# EAGLE design ArduinoBoardMKII (EAGLE 9.1.3)
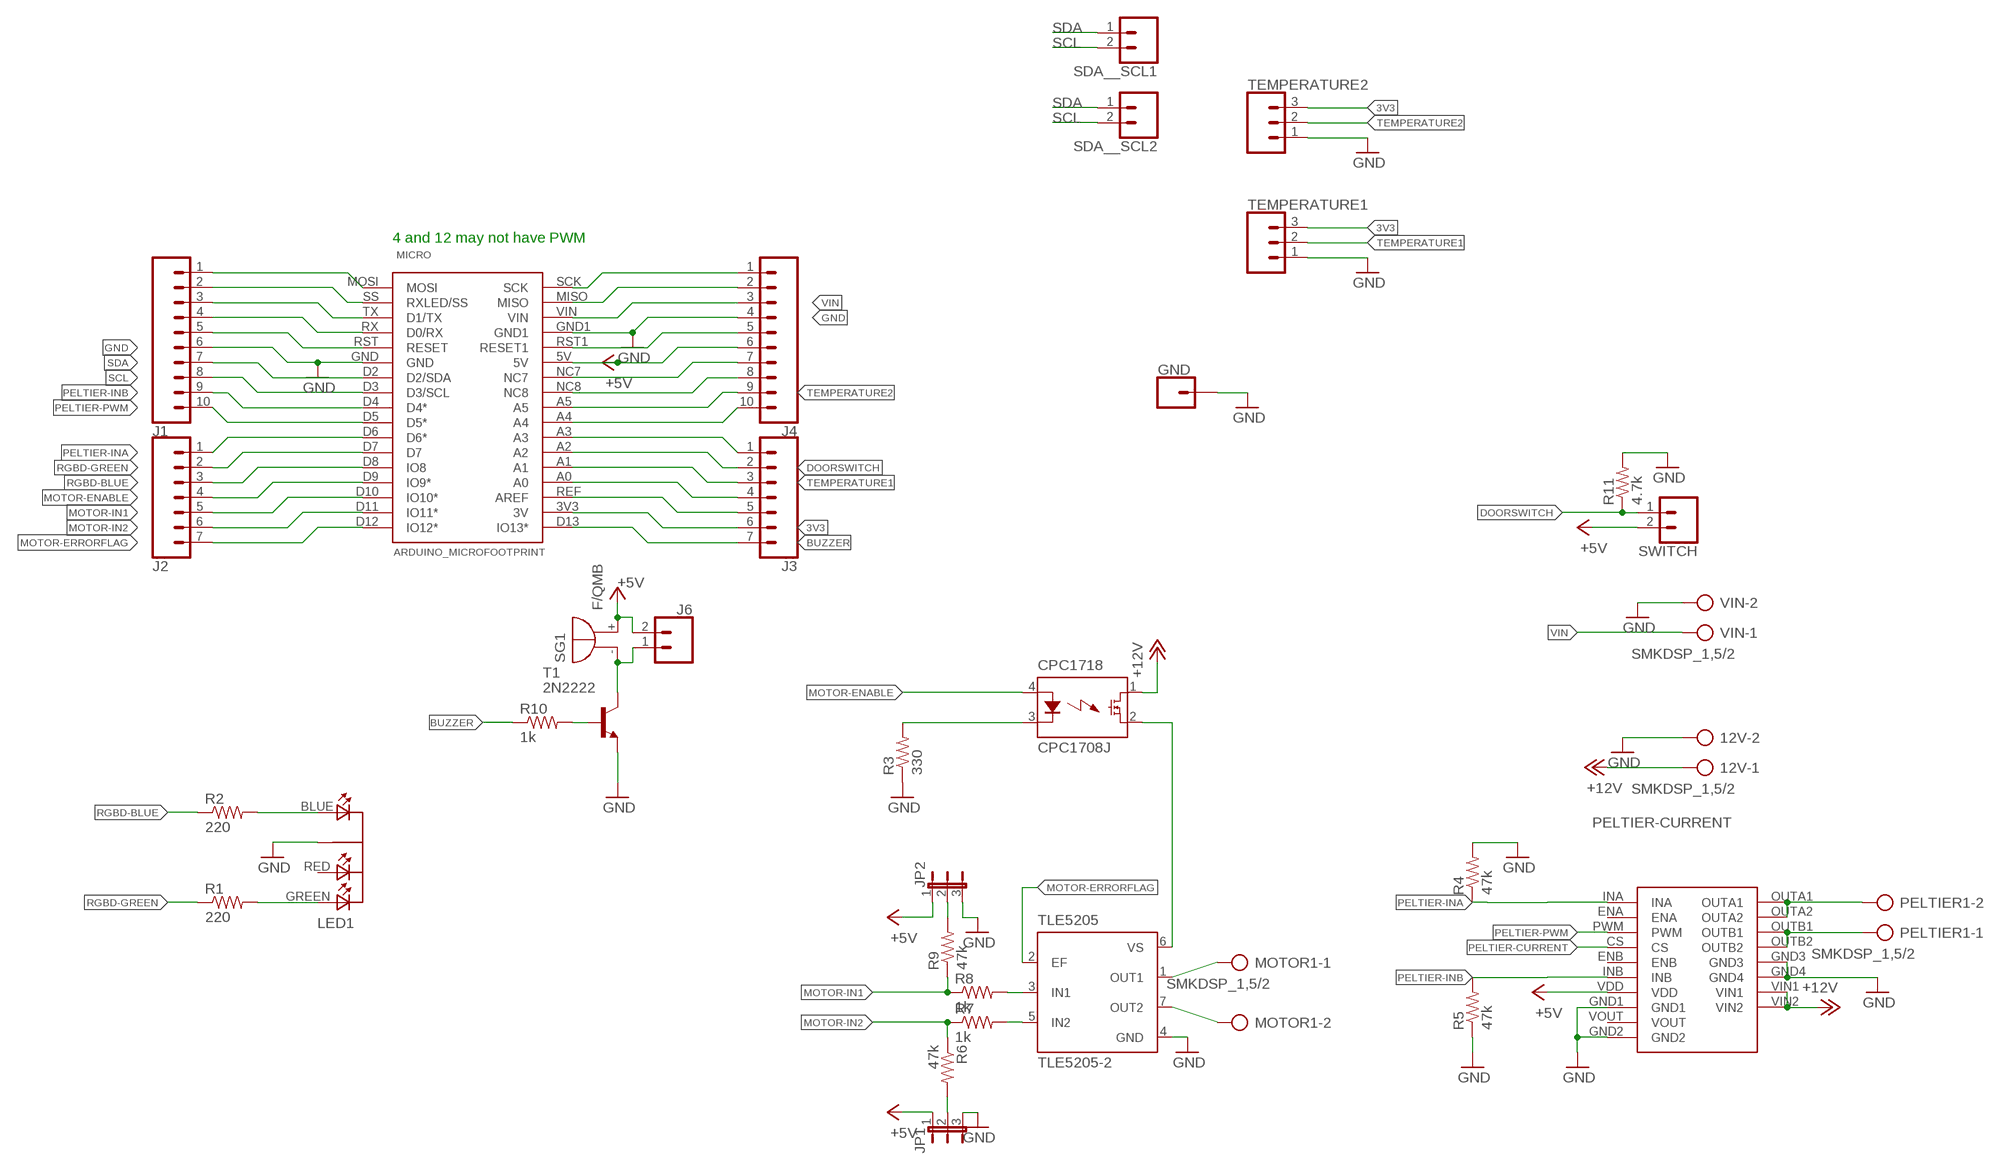
[diagram p0: schematic, sheet 1]

## Parts
12V  SMKDSP_1,5/2  [SMKDSP_1,5/2]
CPC1718  CPC1708J  [I4-PAC]
GND  CONN_01  [1X01]
J1  CONN_10LOCK  [1X10_LOCK]
J2  CONN_07LOCK  [1X07_LOCK]
J3  CONN_07LOCK  [1X07_LOCK]
J4  CONN_10LOCK  [1X10_LOCK]
J6  CONN_021X02_NO_SILK  [1X02_NO_SILK]
JP1  JP2E  [JP2]
JP2  JP2E  [JP2]
LED1  LED-DIP-3  [DIP-4]
MICRO  ARDUINO_MICROFOOTPRINT  [ARDUINO-MICRO]
MOTOR1  SMKDSP_1,5/2  [SMKDSP_1,5/2]
PELTIER1  SMKDSP_1,5/2  [SMKDSP_1,5/2]
R1  220  R-US_0207/10  [0207/10]
R2  220  R-US_0207/10  [0207/10]
R3  330  R-US_0207/10  [0207/10]
R4  47k  R-US_0207/10  [0207/10]
R5  47k  R-US_0207/10  [0207/10]
R6  47k  R-US_0207/12  [0207/12]
R7  1k  R-US_0207/12  [0207/12]
R8  1k  R-US_0207/12  [0207/12]
R9  47k  R-US_0207/12  [0207/12]
R10  1k  R-US_0207/7  [0207/7]
R11  4.7k  R-US_0207/10  [0207/10]
SDA__SCL1  CONN_02PTH3  [1X02_LONGPADS]
SDA__SCL2  CONN_02PTH3  [1X02_LONGPADS]
SG1  F/QMB  [F/QMB]
SWITCH  CONN_02PTH3  [1X02_LONGPADS]
T1  2N2222  [TO18]
TEMPERATURE1  CONN_03LONGPADS  [1X03_LONGPADS]
TEMPERATURE2  CONN_03LONGPADS  [1X03_LONGPADS]
TLE5205  TLE5205-2  [P-TO220-7-11]
VIN  SMKDSP_1,5/2  [SMKDSP_1,5/2]
VNH5019  VNH5019VNH5019BOARD  [DIP3302W60P254L2400H500Q20B]

## Nets
3V3: J3.6 MICRO.3V3(3V) TEMPERATURE1.3 TEMPERATURE2.3
+5V: J4.6 J6.2 JP1.1 JP2.1 MICRO.5V SG1.+(-) SWITCH.2 VNH5019.VDD
+12V: 12V.1 CPC1718.1(DS1) VNH5019.VIN1 VNH5019.VIN2
BUZZER: J3.7 MICRO.D13(IO13*) R10.1
DOORSWITCH: J3.2 MICRO.A2 R11.1 SWITCH.1
GND: 12V.2 GND.1 J1.6 J4.4 JP1.3 JP2.3 LED1.COMMON_CATHODE(COM-CATHODE) MICRO.GND MICRO.GND1 R3.1 R4.2 R5.1 R11.2 T1.1(E) TEMPERATURE1.1 TEMPERATURE2.1 TLE5205.4(GND) VIN.2 VNH5019.GND1 VNH5019.GND2 VNH5019.GND3 VNH5019.GND4
IN1: R8.2 TLE5205.3(IN1)
IN2: R7.2 TLE5205.5(IN2)
MOTOR-ENABLE: CPC1718.4(A) J2.4 MICRO.D9(IO9*)
MOTOR-ERRORFLAG: J2.7 MICRO.D12(IO12*) TLE5205.2(EF)
MOTOR-IN1: J2.5 MICRO.D10(IO10*) R8.1 R9.1
MOTOR-IN2: J2.6 MICRO.D11(IO11*) R6.1 R7.1
MOTOR-OUT1: MOTOR1.1 TLE5205.1(OUT1)
MOTOR-OUT2: MOTOR1.2 TLE5205.7(OUT2)
N$2: LED1.BLUE R2.2
N$3: LED1.GREEN R1.2
N$4: JP1.2 R6.2
N$6: J1.5 MICRO.RST(RESET)
N$7: J1.4 MICRO.RX(D0/RX)
N$8: J1.3 MICRO.TX(D1/TX)
N$9: J1.2 MICRO.SS(RXLED/SS)
N$10: J1.1 MICRO.MOSI
N$11: J3.1 MICRO.A3
N$12: JP2.2 R9.2
N$13: J6.1 SG1.-(+) T1.3(C)
N$14: J3.4 MICRO.A0
N$15: J3.5 MICRO.REF(AREF)
N$17: R10.2 T1.2(B)
N$18: J4.10 MICRO.A4
N$19: J4.5 MICRO.RST1(RESET1)
N$20: J4.8 MICRO.NC8
N$23: J4.7 MICRO.NC7
N$25: J4.2 MICRO.MISO
N$26: J4.1 MICRO.SCK
PELTIER-CURRENT: VNH5019.CS
PELTIER-INA: J2.1 MICRO.D6(D6*) R4.1 VNH5019.INA
PELTIER-INB: J1.9 MICRO.D4(D4*) R5.2 VNH5019.INB
PELTIER-OUTA: PELTIER1.2 VNH5019.OUTA1 VNH5019.OUTA2
PELTIER-OUTB: PELTIER1.1 VNH5019.OUTB1 VNH5019.OUTB2
PELTIER-PWM: J1.10 MICRO.D5(D5*) VNH5019.PWM
POST-OPTO-DIODE: CPC1718.3(K) R3.2
RELAY-TO-MOTORCONTROLLER: CPC1718.2(DS2) TLE5205.6(VS)
RGBD-BLUE: J2.3 MICRO.D8(IO8) R2.1
RGBD-GREEN: J2.2 MICRO.D7 R1.1
SCL: J1.8 MICRO.D3(D3/SCL) SDA__SCL1.2 SDA__SCL2.2
SDA: J1.7 MICRO.D2(D2/SDA) SDA__SCL1.1 SDA__SCL2.1
TEMPERATURE1: J3.3 MICRO.A1 TEMPERATURE1.2
TEMPERATURE2: J4.9 MICRO.A5 TEMPERATURE2.2
VIN: J4.3 MICRO.VIN VIN.1
Unconnected: LED1.RED VNH5019.ENA VNH5019.ENB VNH5019.VOUT

## Notes on the sheet
- 4 and 12 may not have PWM

## Library data of the parts
12V MOTOR1 PELTIER1 VIN = con-phoenix-smkdsp:SMKDSP_1,5/2: Printklemme, Nennstrom: 17,5 A, Bemessungsspannung: 250 V, Raster: 5,0 mm Source: http://eshop.phoenixcontact.de .. 1733415.pdf; MF: FARNELL; MPN: 1733570; OC_FARNELL: 3041244; OC_NEWARK: 69C8588
CPC1718 = relay:CPC1708J: Single-Pole, Normally Open i4-PAC (TM) DC Power Relay Source: Data sheet <http://www.clare.com/home/pdfs.nsf/www/CPC1708.pdf/$file/CPC1708.pdf>
GND = SparkFun-Connectors:CONN_01: Single connection point. Often used as Generic Header-pin footprint for 0.1 inch spaced/style header connections On any of the 0.1 inch spaced packages, you can populate with these: Break Away Headers - Straight <https://www.sparkfun.com/products/116> (PRT-00116) Break Away Male Headers - Right Angle <https://www.sparkfun.com/products/553> (PRT-00553) Female Headers <https://www.sparkfun.com/products/115> (PRT-00115) Break Away Headers - Machine Pin <https://www.sparkfun.com/products/117> (PRT-00117) Break Away Female Headers - Swiss Machine Pin <https://www.sparkfun.com/products/743> (PRT-00743) This device is also useful as a general connection point to wire up your design to another part of your project. Our various solder wires solder well into these plated through hole pads. Hook-Up Wire - Assortment (Stranded, 22 AWG) <https://www.sparkfun.com/products/11375> (PRT-11375) Hook-Up Wire - Assortment (Solid Core, 22 AWG) <https://www.sparkfun.com/products/11367> (PRT-11367) View the entire wire category on our website here <https://www.sparkfun.com/categories/141> Special notes: SMTSO-256-ET is a "flush mount" nut for a 4-40 screw. We mostly use this on specialty testbeds; it is a nice way to connect hardware to your PCB at an adjustable hieght. Also note, the SNAP packages are for using a snappable style connector. We sell a baggie of snaps and they are also used on two LilyPad designs: Snap Assortment - 30 pack (male and female) <https://www.sparkfun.com/products/11347> (DEV-11347) LilyPad Arduino SimpleSnap <https://www.sparkfun.com/products/10941> (DEV-10941) LilyPad SimpleSnap Protoboard <https://www.sparkfun.com/products/10940> (DEV-10940)
J1 J4 = SparkFun-Connectors:CONN_10: Multi connection point. Often used as Generic Header-pin footprint for 0.1 inch spaced/style header connections On any of the 0.1 inch spaced packages, you can populate with these: Break Away Headers - Straight <https://www.sparkfun.com/products/116> (PRT-00116) Break Away Male Headers - Right Angle <https://www.sparkfun.com/products/553> (PRT-00553) Female Headers <https://www.sparkfun.com/products/115> (PRT-00115) Break Away Headers - Machine Pin <https://www.sparkfun.com/products/117> (PRT-00117) Break Away Female Headers - Swiss Machine Pin <https://www.sparkfun.com/products/743> (PRT-00743) Arduino Stackable Header - 10 Pin <https://www.sparkfun.com/products/11376> (PRT-11376) For SCREWTERMINALS and SPRING TERMINALS visit here: Screw Terimnals on SparkFun.com <https://www.sparkfun.com/search/results?term=Screw+Terminals> (5mm/3.5mm/2.54mm spacing) This device is also useful as a general connection point to wire up your design to another part of your project. Our various solder wires solder well into these plated through hole pads. Hook-Up Wire - Assortment (Stranded, 22 AWG) <https://www.sparkfun.com/products/11375> (PRT-11375) Hook-Up Wire - Assortment (Solid Core, 22 AWG) <https://www.sparkfun.com/products/11367> (PRT-11367) View the entire wire category on our website here <https://www.sparkfun.com/categories/141> Special notes: Molex polarized connector foot print use with SKU : PRT-08231 with associated crimp pins and housings. 1MM SMD Version SKU: PRT-10208 NOTES ON THE VARIANTS LOCK and LOCK_LONGPADS... This footprint was designed to help hold the alignment of a through-hole component (i.e. 6-pin header) while soldering it into place. You may notice that each hole has been shifted either up or down by 0.005 of an inch from it's more standard position (which is a perfectly straight line). This slight alteration caused the pins (the squares in the middle) to touch the edges of the holes. Because they are alternating, it causes a "brace" to hold the component in place. 0.005 has proven to be the perfect amount of "off-center" position when using our standard breakaway headers. Although looks a little odd when you look at the bare footprint, once you have a header in there, the alteration is very hard to notice. Also,if you push a header all the way into place, it is covered up entirely on the bottom side.
J2 J3 = SparkFun-Connectors:CONN_07: Multi connection point. Often used as Generic Header-pin footprint for 0.1 inch spaced/style header connections On any of the 0.1 inch spaced packages, you can populate with these: Break Away Headers - Straight <https://www.sparkfun.com/products/116> (PRT-00116) Break Away Male Headers - Right Angle <https://www.sparkfun.com/products/553> (PRT-00553) Female Headers <https://www.sparkfun.com/products/115> (PRT-00115) Break Away Headers - Machine Pin <https://www.sparkfun.com/products/117> (PRT-00117) Break Away Female Headers - Swiss Machine Pin <https://www.sparkfun.com/products/743> (PRT-00743) For SCREWTERMINALS and SPRING TERMINALS visit here: Screw Terimnals on SparkFun.com <https://www.sparkfun.com/search/results?term=Screw+Terminals> (5mm/3.5mm/2.54mm spacing) This device is also useful as a general connection point to wire up your design to another part of your project. Our various solder wires solder well into these plated through hole pads. Hook-Up Wire - Assortment (Stranded, 22 AWG) <https://www.sparkfun.com/products/11375> (PRT-11375) Hook-Up Wire - Assortment (Solid Core, 22 AWG) <https://www.sparkfun.com/products/11367> (PRT-11367) View the entire wire category on our website here <https://www.sparkfun.com/categories/141> Special notes: Molex polarized connector foot print use with SKU : PRT-08231 with associated crimp pins and housings. 1MM SMD Version SKU: PRT-10208 NOTES ON THE VARIANTS LOCK and LOCK_LONGPADS... This footprint was designed to help hold the alignment of a through-hole component (i.e. 6-pin header) while soldering it into place. You may notice that each hole has been shifted either up or down by 0.005 of an inch from it's more standard position (which is a perfectly straight line). This slight alteration caused the pins (the squares in the middle) to touch the edges of the holes. Because they are alternating, it causes a "brace" to hold the component in place. 0.005 has proven to be the perfect amount of "off-center" position when using our standard breakaway headers. Although looks a little odd when you look at the bare footprint, once you have a header in there, the alteration is very hard to notice. Also,if you push a header all the way into place, it is covered up entirely on the bottom side.
J6 SDA__SCL1 SDA__SCL2 SWITCH = SparkFun-Connectors:CONN_02: Multi connection point. Often used as Generic Header-pin footprint for 0.1 inch spaced/style header connections On any of the 0.1 inch spaced packages, you can populate with these: Break Away Headers - Straight <https://www.sparkfun.com/products/116> (PRT-00116) Break Away Male Headers - Right Angle <https://www.sparkfun.com/products/553> (PRT-00553) Female Headers <https://www.sparkfun.com/products/115> (PRT-00115) Break Away Headers - Machine Pin <https://www.sparkfun.com/products/117> (PRT-00117) Break Away Female Headers - Swiss Machine Pin <https://www.sparkfun.com/products/743> (PRT-00743) For SCREWTERMINALS and SPRING TERMINALS visit here: Screw Terimnals on SparkFun.com <https://www.sparkfun.com/search/results?term=Screw+Terminals> (5mm/3.5mm/2.54mm spacing) This device is also useful as a general connection point to wire up your design to another part of your project. Our various solder wires solder well into these plated through hole pads. Hook-Up Wire - Assortment (Stranded, 22 AWG) <https://www.sparkfun.com/products/11375> (PRT-11375) Hook-Up Wire - Assortment (Solid Core, 22 AWG) <https://www.sparkfun.com/products/11367> (PRT-11367) View the entire wire category on our website here <https://www.sparkfun.com/categories/141> Special notes: Molex polarized connector foot print use with: PRT-08233 with associated crimp pins and housings. 2.54_SCREWTERM for use with PRT-10571. 3.5mm Screw Terminal footprints for PRT-08084 5mm Screw Terminal footprints for use with PRT-08432
JP1 JP2 = jumper:JP2E: JUMPER
LED1 = _led-rgb:LED-DIP-3: RGB DIP LED Edited: brunql DIP 4 Pin Special for AmbilightUSB
MICRO = arduino-micro:ARDUINO_MICRO
R1-R3 R11 = adafruit:R-US_: RESISTOR, American symbol
R4-R9 = resistor:R-US_: RESISTOR, American symbol
R10 = rcl:R-US_: RESISTOR, American symbol; SPICEPREFIX: R
SG1 = buzzer:F/QMB: BUZZER Source: Buerklin; OC_FARNELL: unknown; OC_NEWARK: unknown
T1 = transistor:2N2222: NPN TRANSISTOR
TEMPERATURE1 TEMPERATURE2 = SparkFun-Connectors:CONN_03: Multi connection point. Often used as Generic Header-pin footprint for 0.1 inch spaced/style header connections On any of the 0.1 inch spaced packages, you can populate with these: Break Away Headers - Straight <https://www.sparkfun.com/products/116> (PRT-00116) Break Away Male Headers - Right Angle <https://www.sparkfun.com/products/553> (PRT-00553) Female Headers <https://www.sparkfun.com/products/115> (PRT-00115) Break Away Headers - Machine Pin <https://www.sparkfun.com/products/117> (PRT-00117) Break Away Female Headers - Swiss Machine Pin <https://www.sparkfun.com/products/743> (PRT-00743) Stackable Header - 3 Pin (Female, 0.1") <https://www.sparkfun.com/products/13875> (PRT-13875) For SCREWTERMINALS and SPRING TERMINALS visit here: Screw Terimnals on SparkFun.com <https://www.sparkfun.com/search/results?term=Screw+Terminals> (5mm/3.5mm/2.54mm spacing) This device is also useful as a general connection point to wire up your design to another part of your project. Our various solder wires solder well into these plated through hole pads. Hook-Up Wire - Assortment (Stranded, 22 AWG) <https://www.sparkfun.com/products/11375> (PRT-11375) Hook-Up Wire - Assortment (Solid Core, 22 AWG) <https://www.sparkfun.com/products/11367> (PRT-11367) View the entire wire category on our website here <https://www.sparkfun.com/categories/141> Special notes: Molex polarized connector foot print use with SKU : PRT-08232 with associated crimp pins and housings.
TLE5205 = infineon:TLE5205-2: 5-A H-Bridge for DC-Motor Applications Source: http://www.infineon.com .. tle5205-2.pdf; OC_FARNELL: unknown; OC_NEWARK: unknown
VNH5019 = GEMS:VNH5019

## Board
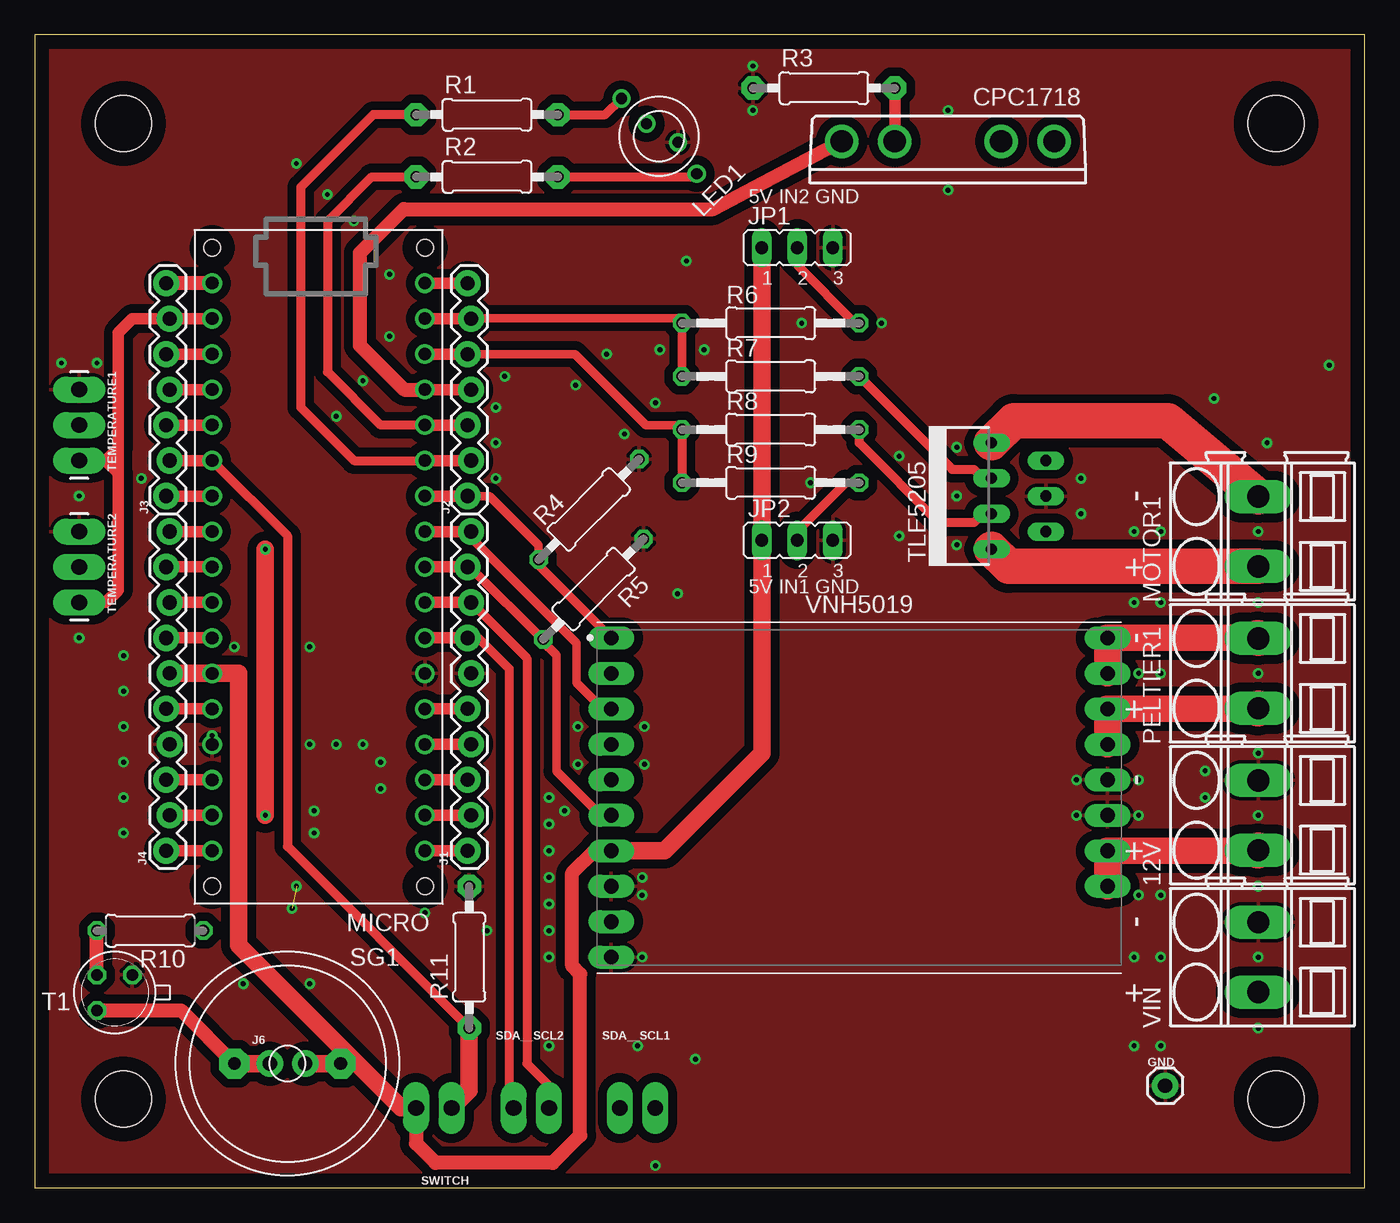
[diagram p1: board, top side]
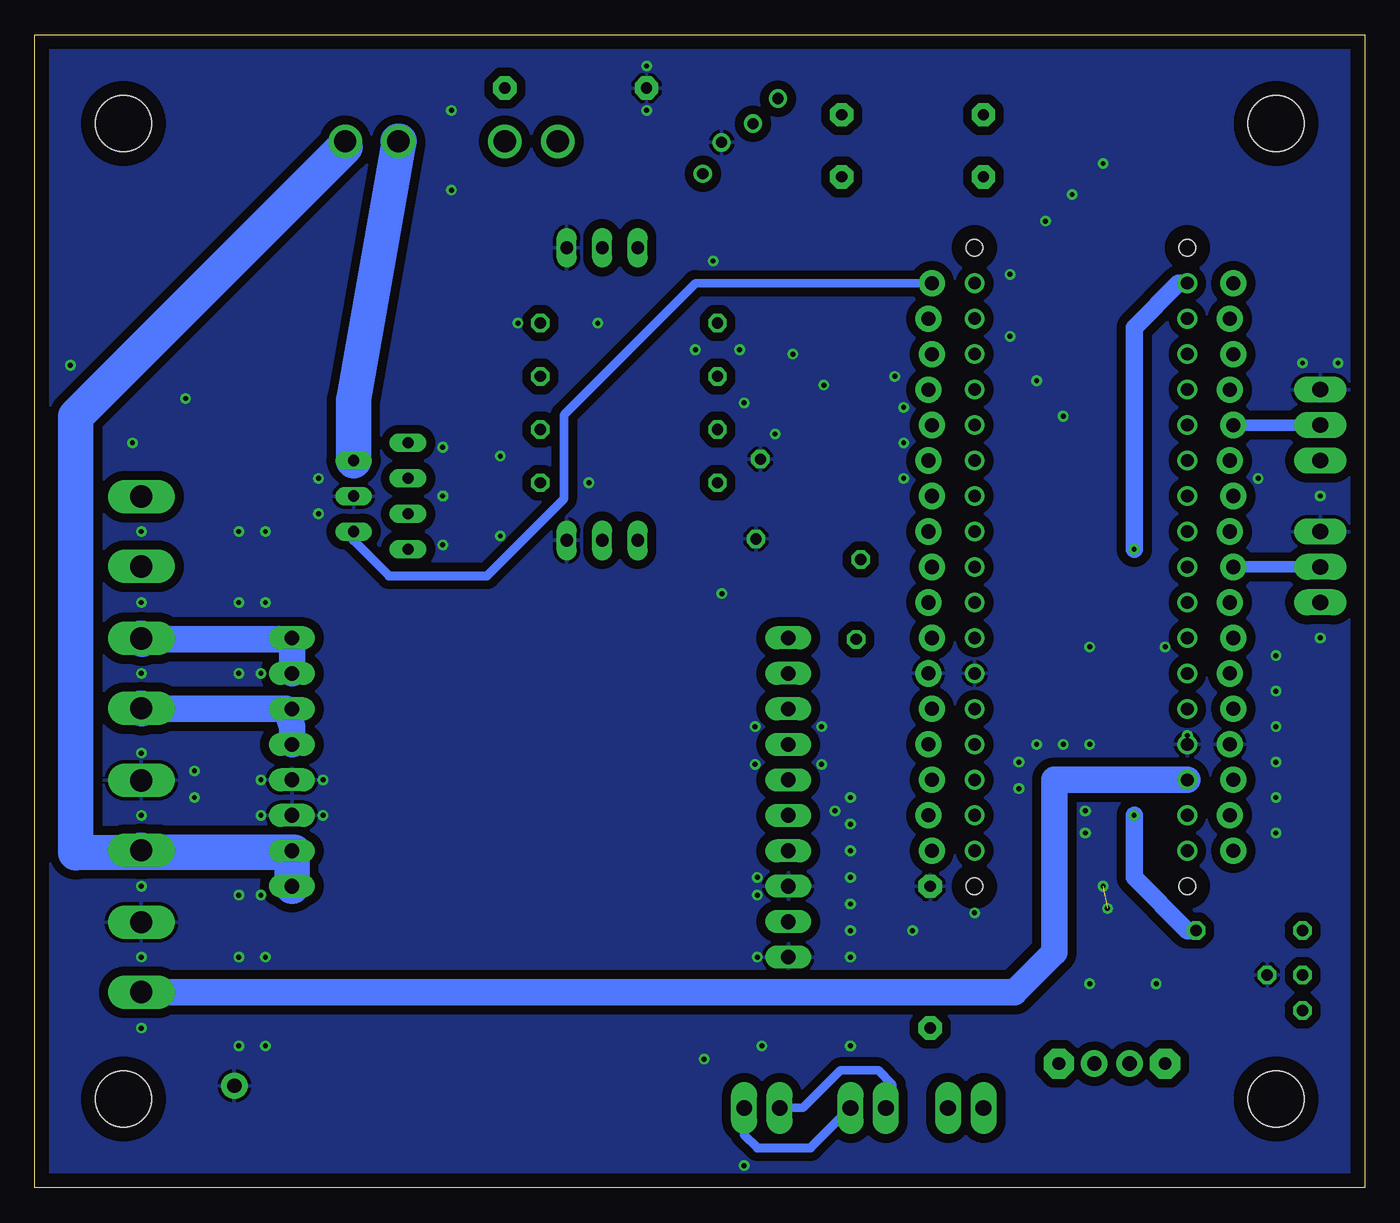
[diagram p2: board, bottom side, seen from below]

Size 95.25 x 82.55 mm. Coordinates in mm from the lower left corner, seen from the top.
Outline: 0,0 95.25,0 95.25,82.55 0,82.55 0,0
Copper layers (1*16): Top 0.035mm / dielectric 1.5mm / Bottom 0.035mm
Design rules "default *": minimum track width 6mil, minimum drill 0.35mm, track to track 25mil, track to pad 20mil, pad to pad 6mil, via to via 25mil, smd to smd 6mil, copper to edge 40mil, drill to drill 6mil, minimum pad ring 10mil, minimum via ring 8mil, stop-mask expansion 4mil, vias tented up to drill 0mil, thermal gap 10mil
Holes 4 mm at 6.35,76.2 88.9,76.2 88.9,6.35 6.35,6.35

### Footprints (pad centres in the part's own frame; a part is rotated, then mirrored left to right if it is on the bottom)
SMKDSP_1,5/2 = drill 1.6 pad 1.8 long: 1 -2.5,0; 2 2.5,0
I4-PAC = drill 1.6 pad 2.3: 1 -7.62,0; 2 -3.81,0; 3 3.81,0; 4 7.62,0
1X01 = drill 1.016 pad 1.88: 1 0,0
1X10_LOCK = drill 1.016 pad 1.88: 1 0,0.127; 2 2.54,-0.127; 3 5.08,0.127; 4 7.62,-0.127; 5 10.16,0.127; 6 12.7,-0.127; 7 15.24,0.127; 8 17.78,-0.127; 9 20.32,0.127; 10 22.86,-0.127
1X07_LOCK = drill 1.016 pad 1.88: 1 0,0.127; 2 2.54,-0.127; 3 5.08,0.127; 4 7.62,-0.127; 5 10.16,0.127; 6 12.7,-0.127; 7 15.24,0.127
1X02_NO_SILK = drill 1.016 pad 1.88: 1 0,0; 2 2.54,0
JP2 = drill 0.914 long: 1 -2.54,0; 2 0,0; 3 2.54,0
DIP-4 = drill 0.8: BLUE 0,5.08; COMMON_CATHODE -0.635,2.54; GREEN 0,-2.54; RED 0,0
ARDUINO-MICRO = drill 0.9: 3V3 16.51,3.81; 5V 16.51,29.21; A0 16.51,8.89; A1 16.51,11.43; A2 16.51,13.97; A3 16.51,16.51; A4 16.51,19.05; A5 16.51,21.59; D2 1.27,26.67; D3 1.27,24.13; D4 1.27,21.59; D5 1.27,19.05; D6 1.27,16.51; D7 1.27,13.97; D8 1.27,11.43; D9 1.27,8.89; D10 1.27,6.35; D11 1.27,3.81; D12 1.27,1.27; D13 16.51,1.27; GND 1.27,29.21; GND1 16.51,34.29; MISO 16.51,39.37; MOSI 1.27,41.91; NC7 16.51,26.67; NC8 16.51,24.13; REF 16.51,6.35; RST 1.27,31.75; RST1 16.51,31.75; RX 1.27,34.29; SCK 16.51,41.91; SS 1.27,39.37; TX 1.27,36.83; VIN 16.51,36.83 | hole 1.2: 1.27,-1.27; 16.51,-1.27; 1.27,44.45; 16.51,44.45
0207/10 = drill 0.813 pad 1.676 octagon: 1 -5.08,0; 2 5.08,0
0207/10' = drill 0.813 octagon: 1 -5.08,0; 2 5.08,0
0207/12 = drill 0.813 octagon: 1 -6.35,0; 2 6.35,0
0207/7 = drill 0.813 octagon: 1 -3.81,0; 2 3.81,0
1X02_LONGPADS = drill 1.118 pad 1.88 long: 1 0,0; 2 2.54,0
F/QMB = drill 0.914 pad 2.159 octagon: + 3.81,0; - -3.81,0
TO18 = drill 0.813 octagon: 1 -1.27,-1.27; 2 1.27,-1.27; 3 1.27,1.27
1X03_LONGPADS = drill 1.118 pad 1.88 long: 1 0,0; 2 2.54,0; 3 5.08,0
P-TO220-7-11 = drill 0.8 pad 1.2 long: 1 -3.81,-1.85; 2 -2.54,-5.75; 3 -1.27,-1.85; 4 0,-5.75; 5 1.27,-1.85; 6 2.54,-5.75; 7 3.81,-1.85
DIP3302W60P254L2400H500Q20B = drill 1.048 pad 1.649 long: CS -17.78,3.81; ENA -17.78,8.89; ENB -17.78,1.27; GND1 -17.78,-6.35; GND2 -17.78,-11.43; GND3 17.78,1.27; GND4 17.78,-1.27; INA -17.78,11.43; INB -17.78,-1.27; OUTA1 17.78,11.43; OUTA2 17.78,8.89; OUTB1 17.78,6.35; OUTB2 17.78,3.81; PWM -17.78,6.35; VDD -17.78,-3.81; VIN1 17.78,-3.81; VIN2 17.78,-6.35; VOUT -17.78,-8.89

### Placement (x,y rotation side)
12V  87.63,26.67 90 top
CPC1718  65.41,74.93 180 top
GND  80.96,7.3 0 top
J1  31.11,24.13 90 top
J2  31.11,49.53 90 top
J3  9.53,49.53 90 top
J4  9.53,24.13 90 top
J6  16.83,8.89 0 top
JP1  54.61,67.31 0 top
JP2  54.61,46.35 0 top
LED1  43.81,76.2 225 top
MICRO  29.21,66.04 180 top
MOTOR1  87.63,46.99 90 top
PELTIER1  87.63,36.83 90 top
R1  32.38,76.83 0 top
R2  32.38,72.39 0 top
R3  56.52,78.74 0 top
R4  47k  [0207/10']  39.69,48.58 45 top
R5  47k  [0207/10']  40.01,42.86 225 top
R6  52.7,61.91 0 top
R7  52.7,58.1 0 top
R8  52.7,54.29 0 top
R9  52.7,50.48 0 top
R10  8.26,18.41 180 top
R11  31.11,16.51 90 top
SDA__SCL1  41.91,5.71 0 top
SDA__SCL2  34.29,5.71 0 top
SG1  18.1,8.89 0 top
SWITCH  29.84,5.71 180 top
T1  5.71,13.97 180 top
TEMPERATURE1  3.17,57.15 270 top
TEMPERATURE2  3.17,46.99 270 top
TLE5205  66.67,49.53 90 top
VIN  87.63,16.51 90 top
VNH5019  59.05,27.94 0 top

### Tracks (layer width: path | path; a pad name or v marks a point on that pad's centre or on a via)
3V3
  Top 0.813: MICRO.3V3 J3.6 6.99,62.23 5.97,61.21 5.97,52.96 | 5.97,52.96 5.08,52.07 | 5.08,52.07 TEMPERATURE1.3 | 5.97,51.18 5.97,42.8 5.08,41.91 TEMPERATURE2.3 | 5.08,52.07 5.97,51.18 | 5.97,51.18 5.97,52.96
+5V
  Top 1.016: SWITCH.2 27.3,3.17 28.7,1.78 37.1,1.78 39.06,3.75 39.06,15.3 38.48,15.88 38.48,22.54 40.08,24.13 VNH5019.VDD
  Top 1.27: VNH5019.VDD 45.09,24.13 52.07,31.11 JP2.1 JP1.1 | J4.6 MICRO.5V 14.61,36.83 14.61,17.35 22.01,9.95 22.49,9.47 | 22.49,9.47 SG1.+ J6.2 | 22.49,9.47 26.24,5.71 SWITCH.2
+12V
  Top 1.905: 87.59,24.13 VNH5019.VIN1 VNH5019.VIN2
  Top 2.54: 87.59,24.13 12V.1
  Bottom 0.508: CPC1718.1 73.03,74.53
  Bottom 2.54: 73.03,74.53 92.31,55.24 92.31,23.97 87.79,24.01 12V.1 87.47,24.01 76.68,24.01 76.83,23.85 VNH5019.VIN2
BUZZER  (via drill 0.35)
  Top 1.016: MICRO.D13 J3.7
  Top 1.27: v16.51,45.72 v16.51,26.67
  Bottom 1.27: v16.51,26.67 16.51,22.23 12.7,18.41 R10.1 | v16.51,45.72 16.51,61.59 13.34,64.77 MICRO.D13
DOORSWITCH
  Top 0.635: SWITCH.1 29.84,6.67 | R11.1 18.1,24.45 18.1,46.67 MICRO.A2
  Top 0.813: MICRO.A2 J3.2
  Top 1.27: R11.1 31.11,6.99 SWITCH.1
GND  (via drill 0.35)  (1 unrouted)
  other vias: 66.04,49.53 38.89,33.02 66.04,53.02 36.83,18.41 36.83,20.32 36.83,22.23 36.83,26.04 36.83,27.94 37.94,26.99 18.73,21.59 43.66,33.02 38.89,30.32 1.91,59.05 4.45,59.05 6.35,33.02 12.7,32.38 27.94,19.68 47.31,9.21 19.68,14.61 43.18,10.16 44.45,1.59 74.61,26.67 74.61,29.21 79.06,26.67 79.06,29.21 36.83,24.13 43.5,16.51 43.5,22.23 43.5,20.95 78.74,41.91 80.64,41.91 79.06,36.83 80.64,36.83 83.82,29.84 87.63,31.11 87.63,26.67 83.82,27.94 79.06,20.95 80.64,20.95 80.64,46.99 78.74,46.99 78.74,16.51 80.64,16.51 14.29,38.73 78.74,10.16 80.64,10.16 19.68,38.73 24.77,28.57 24.77,30.48 21.59,31.75 19.68,31.75 32.38,18.41 18.41,20 61.91,52.39 66.04,46.04 74.93,50.8 74.93,48.26 84.45,56.52 88.27,53.34 51.44,80.33 65.41,71.44 20,26.99 36.83,16.51 23.5,31.75 46.04,42.55 43.66,30.32 65.41,77.15 51.44,77.15 87.63,41.91 87.63,36.83 87.63,21.59 87.63,16.51 87.63,11.43 87.63,46.99 40.96,59.69 38.73,57.47 42.23,53.98 44.77,60.01 47.94,60.01 46.67,66.36 33.02,50.8 33.02,53.34 33.02,55.88 33.66,58.1 44.45,56.2 7.62,50.8 6.35,38.1 6.35,35.56 6.35,30.48 6.35,27.94 6.35,25.4 3.17,49.53 20,25.4 3.17,39.37 54.93,61.91 60.64,61.91 55.56,50.48 61.91,46.67 14.92,14.61 25.4,60.96 23.5,57.78 21.59,55.24 22.86,69.22 20.95,71.12 18.73,73.34 25.4,65.41 92.71,58.9 36.83,10.16
  pour Bottom (isolate 0.381): -0.64,83.82 -0.64,-0.64 99.69,-0.64 99.69,83.82
  pour Top (isolate 0.381): -1.91,85.09 -1.91,-1.27 99.69,-1.27 99.69,85.09
IN1
  Top 0.635: TLE5205.3 67.89,48.26 67.25,47.62 64.77,47.62 59.05,53.34 R8.2
IN2
  Top 0.635: R7.2 65.72,51.44 67.25,51.44 67.89,50.8 TLE5205.5
MOTOR-ENABLE
  Top 0.813: MICRO.D9 J2.4
  Top 1.016: MICRO.D9 26.45,57.15 23.28,60.33 23.28,66.92 26.43,70.07 48.58,70.07 CPC1718.4
MOTOR-ERRORFLAG
  Top 0.813: MICRO.D12 J2.7
  Bottom 0.61: 62.87,43.81 57.35,49.33 57.35,55.36 47.94,64.77 J2.7 | TLE5205.2 72.42,46.35
  Bottom 0.635: 62.87,43.81 69.89,43.81 72.42,46.35
MOTOR-IN1
  Top 0.61: J2.5 38.69,59.69 43.77,54.61 46.04,54.61 R8.1
  Top 0.635: R8.1 R9.1 46.35,52.39
  Top 0.813: MICRO.D10 J2.5
MOTOR-IN2
  Top 0.61: J2.6 31.29,62.28 45.99,62.28 R6.1 R7.1
  Top 0.813: MICRO.D11 J2.6
MOTOR-OUT1
  Top 2.54: MOTOR1.1 69.75,44.49 TLE5205.1
MOTOR-OUT2
  Top 2.54: MOTOR1.2 81.15,54.93 70.11,54.93 TLE5205.7
N$2
  Top 0.635: R2.2 47.19,72.39 LED1.BLUE
N$3
  Top 0.635: R1.2 40.86,76.83 LED1.GREEN
N$4
  Top 0.61: R6.2 58.74,61.91 54.61,66.04 JP1.2
N$6
  Top 0.813: MICRO.RST J1.5
N$7
  Top 0.813: J1.4 MICRO.RX
N$8
  Top 0.813: MICRO.TX J1.3
N$9
  Top 0.813: MICRO.SS J1.2
N$10
  Top 0.813: J1.1 MICRO.MOSI
N$11
  Top 0.813: J3.1 MICRO.A3
N$12
  Top 0.61: R9.2 58.09,50.48 54.61,47 JP2.2
N$13
  Top 1.016: T1.3 10.48,12.7 SG1.-
  Top 1.27: SG1.- J6.1
N$14
  Top 0.813: MICRO.A0 J3.4
N$15
  Top 0.813: MICRO.REF J3.5
N$17
  Top 1.016: T1.2 R10.2
N$18
  Top 0.813: J4.10 MICRO.A4
N$19
  Top 0.813: MICRO.RST1 J4.5
N$20
  Top 0.813: MICRO.NC8 J4.8
N$23
  Top 0.813: MICRO.NC7 J4.7
N$25
  Top 0.813: MICRO.MISO J4.2
N$26
  Top 0.813: MICRO.SCK J4.1
PELTIER-INA
  Top 0.61: VNH5019.INA 35.89,44.76 R4.1 36.09,46.01 32.58,49.53 J2.1
  Top 0.813: J2.1 MICRO.D6
PELTIER-INB
  Top 0.508: VNH5019.INB 41.39,26.62
  Top 0.61: 41.39,26.62 40.57,26.62 37.35,29.83 37.35,38.12 36.31,39.16 R5.2 36.36,39.27 31.33,44.3 31.14,44.3 J1.9
  Top 0.813: MICRO.D4 J1.9
PELTIER-OUTA
  Top 1.905: 87.59,39.37 VNH5019.OUTA1 VNH5019.OUTA2
  Top 2.54: 87.59,39.37 PELTIER1.2
  Bottom 1.905: 87.57,39.27 77.04,39.27 76.94,39.16 76.83,39.22 VNH5019.OUTA2
  Bottom 2.54: 87.57,39.27 PELTIER1.2
PELTIER-OUTB
  Top 1.905: 87.59,34.29 VNH5019.OUTB1 VNH5019.OUTB2
  Top 2.54: 87.59,34.29 PELTIER1.1
  Bottom 1.905: 87.59,34.29 77.26,34.29 76.83,33.02 VNH5019.OUTB2
  Bottom 2.54: 87.59,34.29 PELTIER1.1
PELTIER-PWM
  Top 0.61: J1.10 31.24,46.55 38.81,38.97 38.81,36.15 40.68,34.29 VNH5019.PWM
  Top 0.813: MICRO.D5 J1.10
POST-OPTO-DIODE
  Top 0.813: R3.2 CPC1718.3
RELAY-TO-MOTORCONTROLLER
  Bottom 2.54: TLE5205.6 72.42,56.41 69.17,74.93 CPC1718.2
RGBD-BLUE
  Top 0.635: MICRO.D8 24.77,54.61 20.95,58.42 20.95,69.22 24.13,72.39 R2.1
  Top 0.813: MICRO.D8 J2.3
RGBD-GREEN
  Top 0.635: MICRO.D7 22.86,52.07 19.05,55.88 19.05,71.65 24.24,76.83 R1.1
  Top 0.813: MICRO.D7 J2.2
SCL
  Top 0.635: SDA__SCL2.2 36.83,7.3 35.24,8.89 35.24,37.91 J1.8
  Top 0.813: MICRO.D3 J1.8
  Bottom 0.635: SDA__SCL2.2 39.69,2.86 43.5,2.86 44.45,3.81 SDA__SCL1.2
SDA
  Top 0.61: 33.97,37.15 31.75,39.37 J1.7
  Top 0.635: 33.97,37.15 33.97,6.03 SDA__SCL2.1
  Top 0.813: J1.7 MICRO.D2
  Bottom 0.61: SDA__SCL2.1 33.81,6.2 33.81,7.38 34.83,8.41 37.56,8.41 40.25,5.71 SDA__SCL1.1
TEMPERATURE1
  Top 0.813: MICRO.A1 J3.3
  Bottom 0.813: TEMPERATURE1.2 J3.3
TEMPERATURE2
  Top 0.813: J4.9 MICRO.A5
  Bottom 0.813: J4.9 TEMPERATURE2.2
VIN
  Top 0.813: MICRO.VIN J4.3
  Bottom 1.905: MICRO.VIN 22.23,29.21 22.23,16.87 25.08,14.01 VIN.1

### Text on the board
tNames: 5V IN2 GND | - | + | 5V IN1 GND | - | + | - | + | - | +